# Altium schematic sheet MainCard.SchDoc
size A2
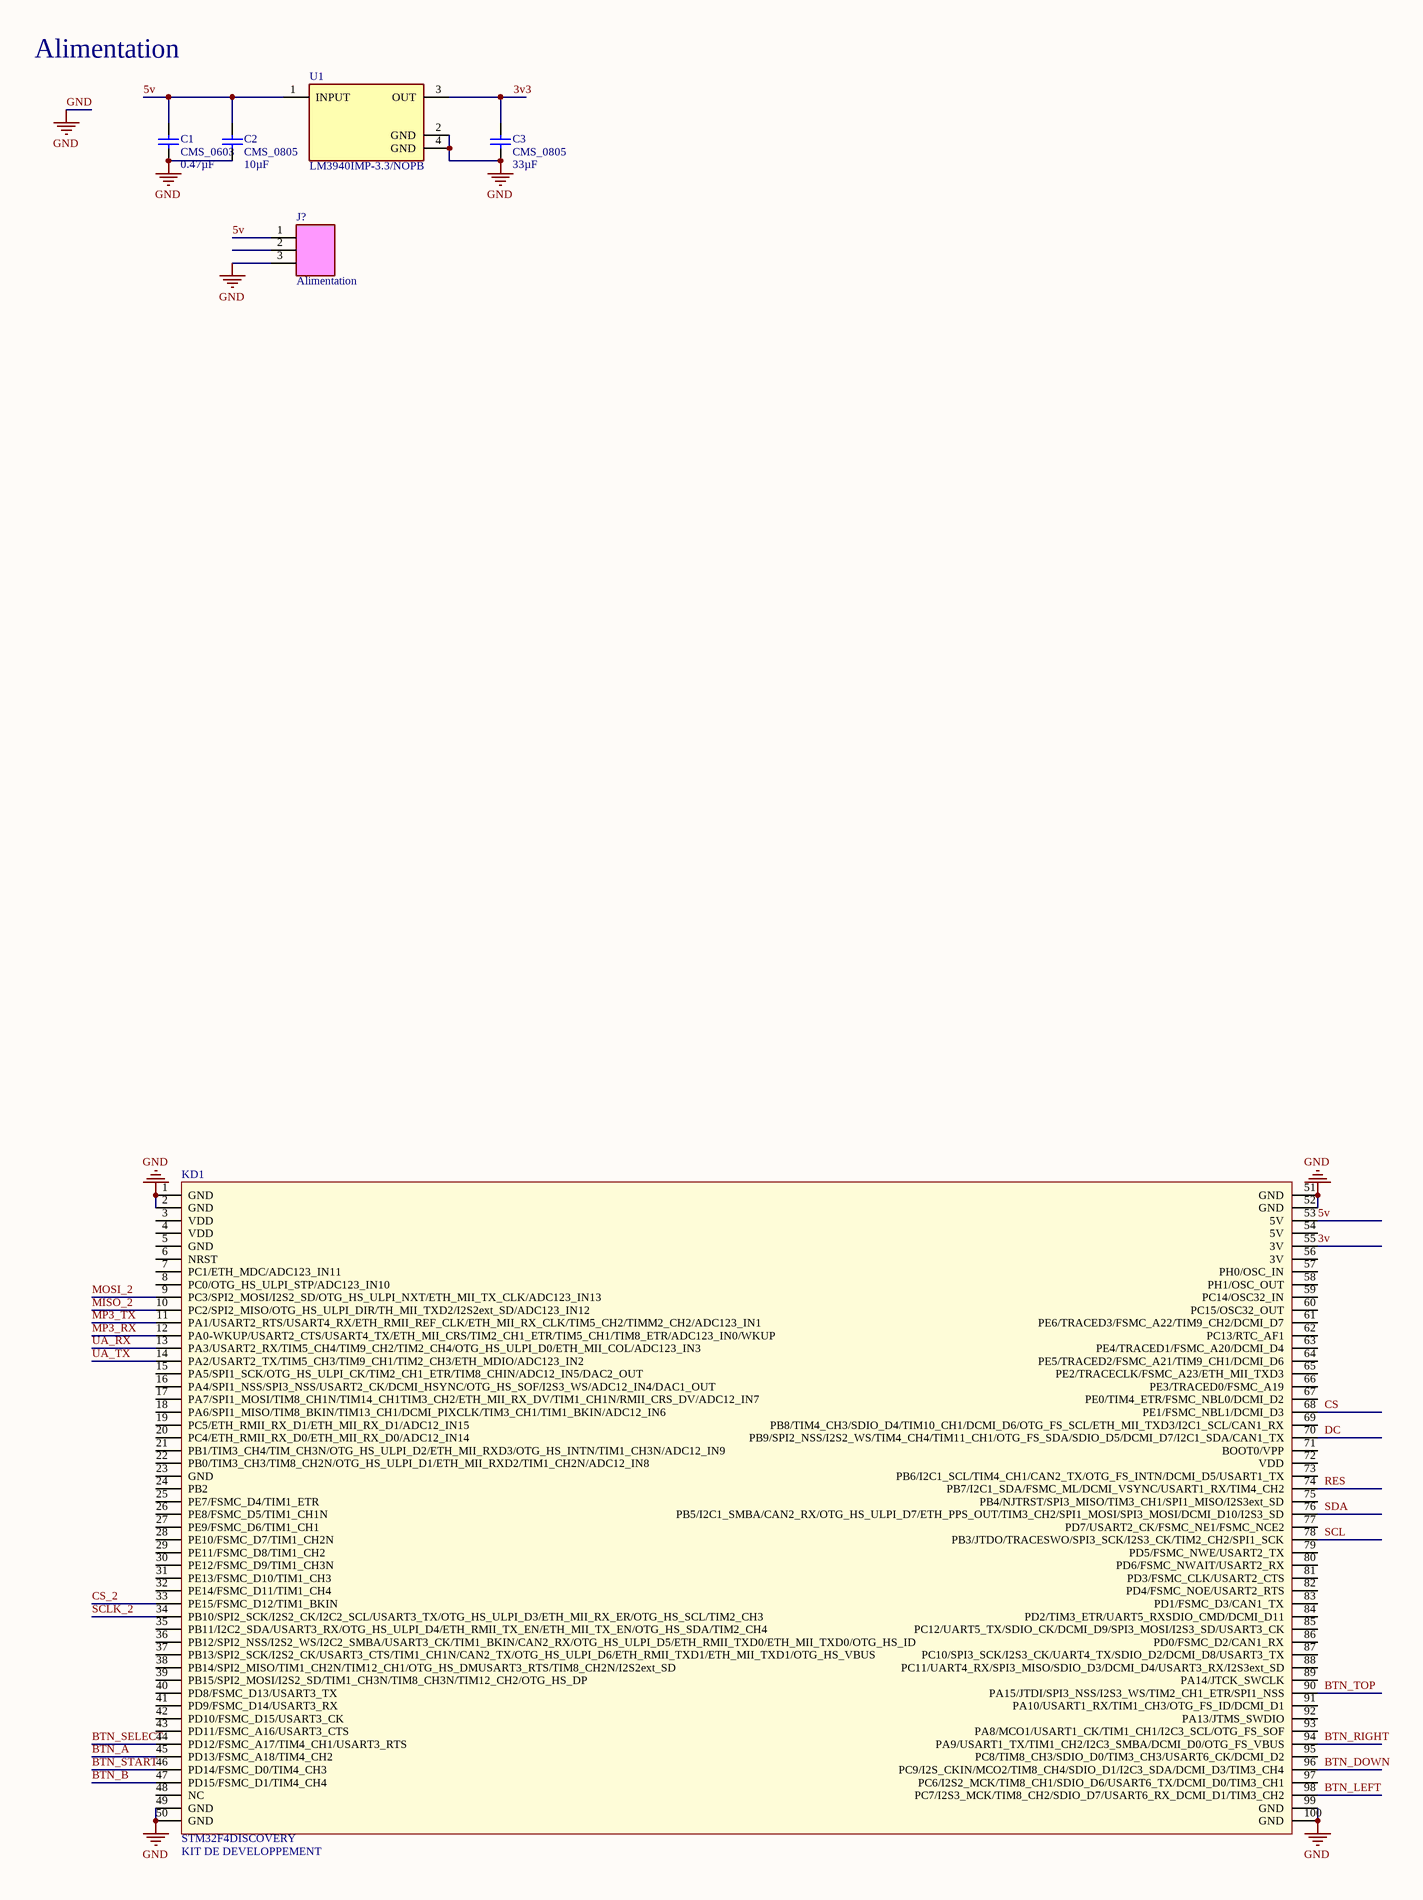
[diagram p0: MainCard.SchDoc, left]
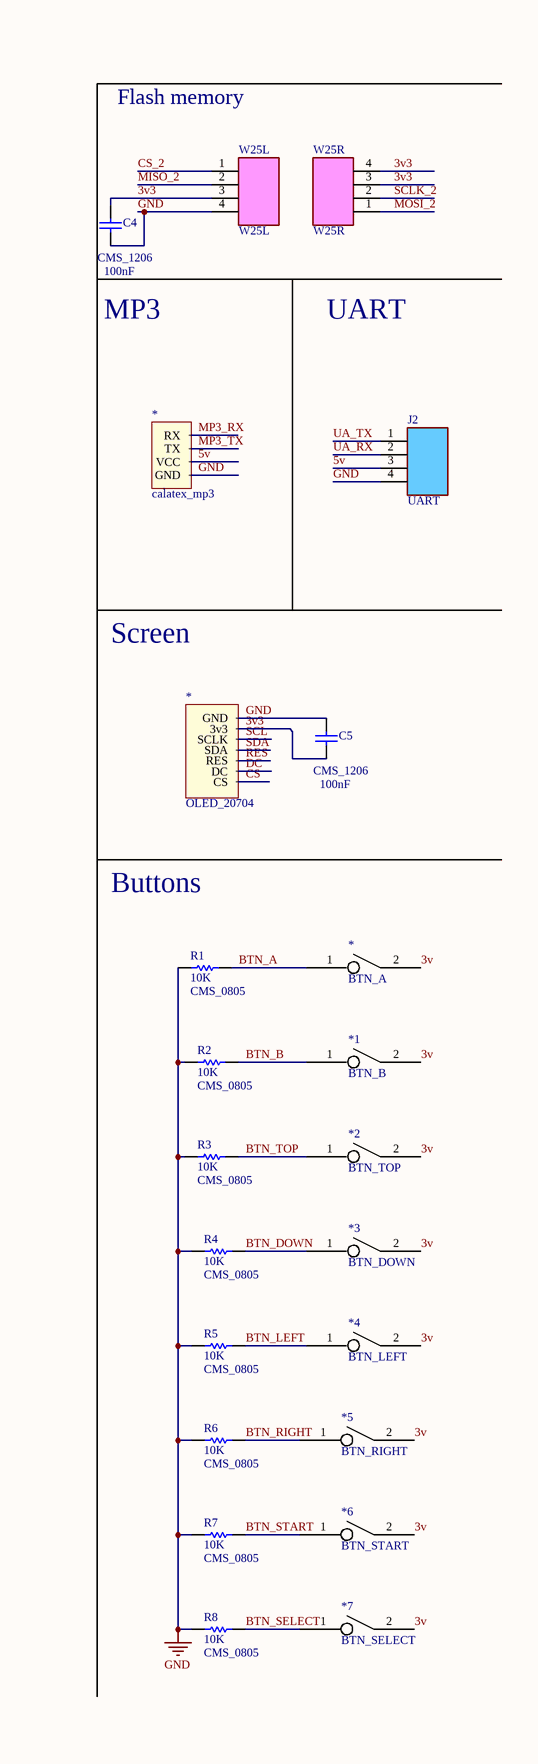
[diagram p1: MainCard.SchDoc, right]

## Parts
(Parts that share a designator on the sheet are numbered #1, #2 ... from top to bottom, then left to right.)
*1  BTN_B  [BTN_R200_1]
*2  BTN_TOP  [BTN_R200_1]
*3  BTN_DOWN  [BTN_R200_1]
*4  BTN_LEFT  [BTN_R200_1]
*5  BTN_RIGHT  [BTN_R200_1]
*6  BTN_START  [BTN_R200_1]
*7  BTN_SELECT  [BTN_R200_1]
*#1  calatex_mp3  [calatex mp3]
*#2  OLED_20704  [OLED_20704]
*#3  BTN_A  [BTN_R200_1]
C1  Condo: 0.47µF  [CONDENSATEUR_CMS_0603]  (hidden comment: CMS_0603)
C2  value 10µF  [CONDENSATEUR_CMS_0805]  (hidden comment: CMS_0805)
C3  value 33µF  [CONDENSATEUR_CMS_0805]  (hidden comment: CMS_0805)
C4  value 100nF  [CONDENSATEUR_CMS_1206]  (hidden comment: CMS_1206)
C5  value 100nF  [CONDENSATEUR_CMS_1206]  (hidden comment: CMS_1206)
J2  Type: UART  [BARRETTE_4_M_D]  (hidden comment: BARRETTE_4 CONTACTS_1 RANGEE_MALE_DROITE)
J?  Type: Alimentation  [BARRETTE_3_F_D]  (hidden comment: BARRETTE 3 CONTACTS 1 RANGEE FEMELLE DROITE)
KD1  STM32F4DISCOVERY  Type: KIT DE DEVELOPPEMENT  [STM32F4DISCOVERY]
R1  value 10K  Type: CMS_0805  [RESISTANCE_CMS_0805]  (hidden comment: RESISTANCE_CMS_0805)
R2  value 10K  Type: CMS_0805  [RESISTANCE_CMS_0805]  (hidden comment: RESISTANCE_CMS_0805)
R3  value 10K  Type: CMS_0805  [RESISTANCE_CMS_0805]  (hidden comment: RESISTANCE_CMS_0805)
R4  value 10K  Type: CMS_0805  [RESISTANCE_CMS_0805]  (hidden comment: RESISTANCE_CMS_0805)
R5  value 10K  Type: CMS_0805  [RESISTANCE_CMS_0805]  (hidden comment: RESISTANCE_CMS_0805)
R6  value 10K  Type: CMS_0805  [RESISTANCE_CMS_0805]  (hidden comment: RESISTANCE_CMS_0805)
R7  value 10K  Type: CMS_0805  [RESISTANCE_CMS_0805]  (hidden comment: RESISTANCE_CMS_0805)
R8  value 10K  Type: CMS_0805  [RESISTANCE_CMS_0805]  (hidden comment: RESISTANCE_CMS_0805)
U1  LM3940IMP-3.3/NOPB  [FP-DCY0004A-IPC_C]
W25L  Type: W25L  [BARRETTE_4_F_D]  (hidden comment: BARRETTE_4 CONTACTS_1 RANGEE_FEMELLE_DROITE)
W25R  Type: W25R  [BARRETTE_4_F_D]  (hidden comment: BARRETTE_4 CONTACTS_1 RANGEE_FEMELLE_DROITE)

## Nets
GND: *#1.4(GND) *#2.1(GND) C1.1 C2.1 C3.1 C4.1 C5.2 J2.4 J?.3 KD1.1(GND) KD1.2(GND) KD1.49(GND) KD1.50(GND) KD1.51(GND) KD1.52(GND) KD1.99(GND) KD1.100(GND) R1.1 R2.1 R3.1 R4.1 R5.1 R6.1 R7.1 R8.1 U1.2(GND) U1.4(GND) W25L.4
3v: *1.2 *2.2 *3.2 *4.2 *5.2 *6.2 *7.2 *#3.2 KD1.55(3V)
3v3: *#2.2(3v3) C3.2 C4.2 C5.1 U1.3(OUT) W25L.3 W25R.3 W25R.4
5v: *#1.3(VCC) C1.2 C2.2 J2.3 J?.1 KD1.53(5V) U1.1(INPUT)
BTN_A: *#3.1 KD1.45(PD13/FSMC_A18/TIM4_CH2) R1.2
BTN_B: *1.1 KD1.47(PD15/FSMC_D1/TIM4_CH4) R2.2
BTN_DOWN: *3.1 KD1.96(PC9/I2S_CKIN/MCO2/TIM8_CH4/SDIO_D1/I2C3_SDA/DCMI_D3/TIM3_CH4) R4.2
BTN_LEFT: *4.1 KD1.98(PC7/I2S3_MCK/TIM8_CH2/SDIO_D7/USART6_RX_DCMI_D1/TIM3_CH2) R5.2
BTN_RIGHT: *5.1 KD1.94(PA9/USART1_TX/TIM1_CH2/I2C3_SMBA/DCMI_D0/OTG_FS_VBUS) R6.2
BTN_SELECT: *7.1 KD1.44(PD12/FSMC_A17/TIM4_CH1/USART3_RTS) R8.2
BTN_START: *6.1 KD1.46(PD14/FSMC_D0/TIM4_CH3) R7.2
BTN_TOP: *2.1 KD1.90(PA15/JTDI/SPI3_NSS/I2S3_WS/TIM2_CH1_ETR/SPI1_NSS) R3.2
CS: *#2.7(CS) KD1.68(PE1/FSMC_NBL1/DCMI_D3)
CS_2: KD1.33(PE15/FSMC_D12/TIM1_BKIN) W25L.1
DC: *#2.6(DC) KD1.70(PB9/SPI2_NSS/I2S2_WS/TIM4_CH4/TIM11_CH1/OTG_FS_SDA/SDIO_D5/DCMI_D7/I2C1_SDA/CAN1_TX)
MISO_2: KD1.10(PC2/SPI2_MISO/OTG_HS_ULPI_DIR/TH_MII_TXD2/I2S2ext_SD/ADC123_IN12) W25L.2
MOSI_2: KD1.9(PC3/SPI2_MOSI/I2S2_SD/OTG_HS_ULPI_NXT/ETH_MII_TX_CLK/ADC123_IN13) W25R.1
MP3_RX: *#1.1(RX) KD1.12(PA0-WKUP/USART2_CTS/USART4_TX/ETH_MII_CRS/TIM2_CH1_ETR/TIM5_CH1/TIM8_ETR/ADC123_IN0/WKUP)
MP3_TX: *#1.2(TX) KD1.11(PA1/USART2_RTS/USART4_RX/ETH_RMII_REF_CLK/ETH_MII_RX_CLK/TIM5_CH2/TIMM2_CH2/ADC123_IN1)
RES: *#2.5(RES) KD1.74(PB7/I2C1_SDA/FSMC_ML/DCMI_VSYNC/USART1_RX/TIM4_CH2)
SCL: *#2.3(SCLK) KD1.78(PB3/JTDO/TRACESWO/SPI3_SCK/I2S3_CK/TIM2_CH2/SPI1_SCK)
SCLK_2: KD1.34(PB10/SPI2_SCK/I2S2_CK/I2C2_SCL/USART3_TX/OTG_HS_ULPI_D3/ETH_MII_RX_ER/OTG_HS_SCL/TIM2_CH3) W25R.2
SDA: *#2.4(SDA) KD1.76(PB5/I2C1_SMBA/CAN2_RX/OTG_HS_ULPI_D7/ETH_PPS_OUT/TIM3_CH2/SPI1_MOSI/SPI3_MOSI/DCMI_D10/I2S3_SD)
UA_RX: J2.2 KD1.13(PA3/USART2_RX/TIM5_CH4/TIM9_CH2/TIM2_CH4/OTG_HS_ULPI_D0/ETH_MII_COL/ADC123_IN3)
UA_TX: J2.1 KD1.14(PA2/USART2_TX/TIM5_CH3/TIM9_CH1/TIM2_CH3/ETH_MDIO/ADC123_IN2)

Not connected (* = marked no-connect by the designer): J? 2; KD1 3(VDD) 4(VDD) 5(GND) 6(NRST) 7(PC1/ETH_MDC/ADC123_IN11) 8(PC0/OTG_HS_ULPI_STP/ADC123_IN10) 15(PA5/SPI1_SCK/OTG_HS_ULPI_CK/TIM2_CH1_ETR/TIM8_CHIN/ADC12_IN5/DAC2_OUT) 16(PA4/SPI1_NSS/SPI3_NSS/USART2_CK/DCMI_HSYNC/OTG_HS_SOF/I2S3_WS/ADC12_IN4/DAC1_OUT) 17(PA7/SPI1_MOSI/TIM8_CH1N/TIM14_CH1TIM3_CH2/ETH_MII_RX_DV/TIM1_CH1N/RMII_CRS_DV/ADC12_IN7) 18(PA6/SPI1_MISO/TIM8_BKIN/TIM13_CH1/DCMI_PIXCLK/TIM3_CH1/TIM1_BKIN/ADC12_IN6) 19(PC5/ETH_RMII_RX_D1/ETH_MII_RX_D1/ADC12_IN15) 20(PC4/ETH_RMII_RX_D0/ETH_MII_RX_D0/ADC12_IN14) 21(PB1/TIM3_CH4/TIM_CH3N/OTG_HS_ULPI_D2/ETH_MII_RXD3/OTG_HS_INTN/TIM1_CH3N/ADC12_IN9) 22(PB0/TIM3_CH3/TIM8_CH2N/OTG_HS_ULPI_D1/ETH_MII_RXD2/TIM1_CH2N/ADC12_IN8) 23(GND) 24(PB2) 25(PE7/FSMC_D4/TIM1_ETR) 26(PE8/FSMC_D5/TIM1_CH1N) 27(PE9/FSMC_D6/TIM1_CH1) 28(PE10/FSMC_D7/TIM1_CH2N) 29(PE11/FSMC_D8/TIM1_CH2) 30(PE12/FSMC_D9/TIM1_CH3N) 31(PE13/FSMC_D10/TIM1_CH3) 32(PE14/FSMC_D11/TIM1_CH4) 35(PB11/I2C2_SDA/USART3_RX/OTG_HS_ULPI_D4/ETH_RMII_TX_EN/ETH_MII_TX_EN/OTG_HS_SDA/TIM2_CH4) 36(PB12/SPI2_NSS/I2S2_WS/I2C2_SMBA/USART3_CK/TIM1_BKIN/CAN2_RX/OTG_HS_ULPI_D5/ETH_RMII_TXD0/ETH_MII_TXD0/OTG_HS_ID) 37(PB13/SPI2_SCK/I2S2_CK/USART3_CTS/TIM1_CH1N/CAN2_TX/OTG_HS_ULPI_D6/ETH_RMII_TXD1/ETH_MII_TXD1/OTG_HS_VBUS) 38(PB14/SPI2_MISO/TIM1_CH2N/TIM12_CH1/OTG_HS_DMUSART3_RTS/TIM8_CH2N/I2S2ext_SD) 39(PB15/SPI2_MOSI/I2S2_SD/TIM1_CH3N/TIM8_CH3N/TIM12_CH2/OTG_HS_DP) 40(PD8/FSMC_D13/USART3_TX) 41(PD9/FSMC_D14/USART3_RX) 42(PD10/FSMC_D15/USART3_CK) 43(PD11/FSMC_A16/USART3_CTS) 48(NC) 54(5V) 56(3V) 57(PH0/OSC_IN) 58(PH1/OSC_OUT) 59(PC14/OSC32_IN) 60(PC15/OSC32_OUT) 61(PE6/TRACED3/FSMC_A22/TIM9_CH2/DCMI_D7) 62(PC13/RTC_AF1) 63(PE4/TRACED1/FSMC_A20/DCMI_D4) 64(PE5/TRACED2/FSMC_A21/TIM9_CH1/DCMI_D6) 65(PE2/TRACECLK/FSMC_A23/ETH_MII_TXD3) 66(PE3/TRACED0/FSMC_A19) 67(PE0/TIM4_ETR/FSMC_NBL0/DCMI_D2) 69(PB8/TIM4_CH3/SDIO_D4/TIM10_CH1/DCMI_D6/OTG_FS_SCL/ETH_MII_TXD3/I2C1_SCL/CAN1_RX) 71(BOOT0/VPP) 72(VDD) 73(PB6/I2C1_SCL/TIM4_CH1/CAN2_TX/OTG_FS_INTN/DCMI_D5/USART1_TX) 75(PB4/NJTRST/SPI3_MISO/TIM3_CH1/SPI1_MISO/I2S3ext_SD) 77(PD7/USART2_CK/FSMC_NE1/FSMC_NCE2) 79(PD5/FSMC_NWE/USART2_TX) 80(PD6/FSMC_NWAIT/USART2_RX) 81(PD3/FSMC_CLK/USART2_CTS) 82(PD4/FSMC_NOE/USART2_RTS) 83(PD1/FSMC_D3/CAN1_TX) 84(PD2/TIM3_ETR/UART5_RXSDIO_CMD/DCMI_D11) 85(PC12/UART5_TX/SDIO_CK/DCMI_D9/SPI3_MOSI/I2S3_SD/USART3_CK) 86(PD0/FSMC_D2/CAN1_RX) 87(PC10/SPI3_SCK/I2S3_CK/UART4_TX/SDIO_D2/DCMI_D8/USART3_TX) 88(PC11/UART4_RX/SPI3_MISO/SDIO_D3/DCMI_D4/USART3_RX/I2S3ext_SD) 89(PA14/JTCK_SWCLK) 91(PA10/USART1_RX/TIM1_CH3/OTG_FS_ID/DCMI_D1) 92(PA13/JTMS_SWDIO) 93(PA8/MCO1/USART1_CK/TIM1_CH1/I2C3_SCL/OTG_FS_SOF) 95(PC8/TIM8_CH3/SDIO_D0/TIM3_CH3/USART6_CK/DCMI_D2) 97(PC6/I2S2_MCK/TIM8_CH1/SDIO_D6/USART6_TX/DCMI_D0/TIM3_CH1)

## Notes on the sheet
- Alimentation
- Flash memory
- MP3
- UART
- Screen
- Buttons

## Library data of the parts
*1-*7 *#3 = BTN_R200_1
C1 = CONDENSATEUR_CMS_CER_0603: CONDENSATEUR CMS CERAMIQUE 0603; Type: CMS_0603
C2 C3 = CONDENSATEUR_CMS_CER_0805: CONDENSATEUR CMS CERAMIQUE 0805; Type: CMS_0805
C4 C5 = CONDENSATEUR_CMS_CER_1206: CONDENSATEUR CMS CERAMIQUE 1206; Type: CMS_1206
J2 = BARRETTE_4 CONTACTS_1 RANGEE_MALE_DROITE: BARRETTE 4 CONTACTS 1 RANGEE MALE DROITE
J? = BARRETTE_3 CONTACTS_1 RANGEE_FEMELLE_DROITE
KD1 = STM32F4DISCOVERY: KIT DE DEVELOPPEMENT POUR MICROCONTROLEUR STM32F407VGT6
R1-R8 = RESISTANCE_CMS_0805: RESISTANCE CMS 0805
U1 = CMP-0062-01788-4: IC REG LINEAR 3.3V 1A SOT223-4; Min Input Voltage: 4.5V; Max Supply Voltage: 7.5V; Number of Outputs: 1; Output Type: Fixed; Polarity: Positive; Dropout Voltage: 500mV; Quiescent Current: 15mA; Max Output Voltage: 3.3V; Length: 6.5mm; Termination: SMD/SMT; Width: 3.56mm; Min Supply Voltage: 4.5V; Max Output Current: 1A; Case/Package: SOT-223; Output Voltage: 3.3V; Current Rating: 1A; Packaging: Tape and Reel; Lead Free: Lead Free; Nominal Output Voltage: 3.3V; Height: 1.6mm; Series: -; Output Configuration: Positive; Radiation Hardening: No; Number of Regulators: 1; Package Quantity: 1000; REACH SVHC: No SVHC; Max Input Voltage: 7.5V; Max Operating Temperature: 125°C; Min Operating Temperature: -40°C; Output Current: 1A; Contact Plating: Tin; Number of Pins: 4; Mount: Surface Mount
W25L W25R = BARRETTE_4 CONTACTS_1 RANGEE_FEMELLE_DROITE: BARRETTE 4 CONTACTS 1 RANGEE FEMELLE DROITE